# EasyEDA schematic SCH_Head-tracking_2023-07-10.json

## Sheets
1 USB_UART: TITLE: USB_UART CONTROLLER; REV: 1.0; Date: 2022-03-29; Sheet: 1/1; Drawn By: digitalman; Company: Analog-Digital Ltd
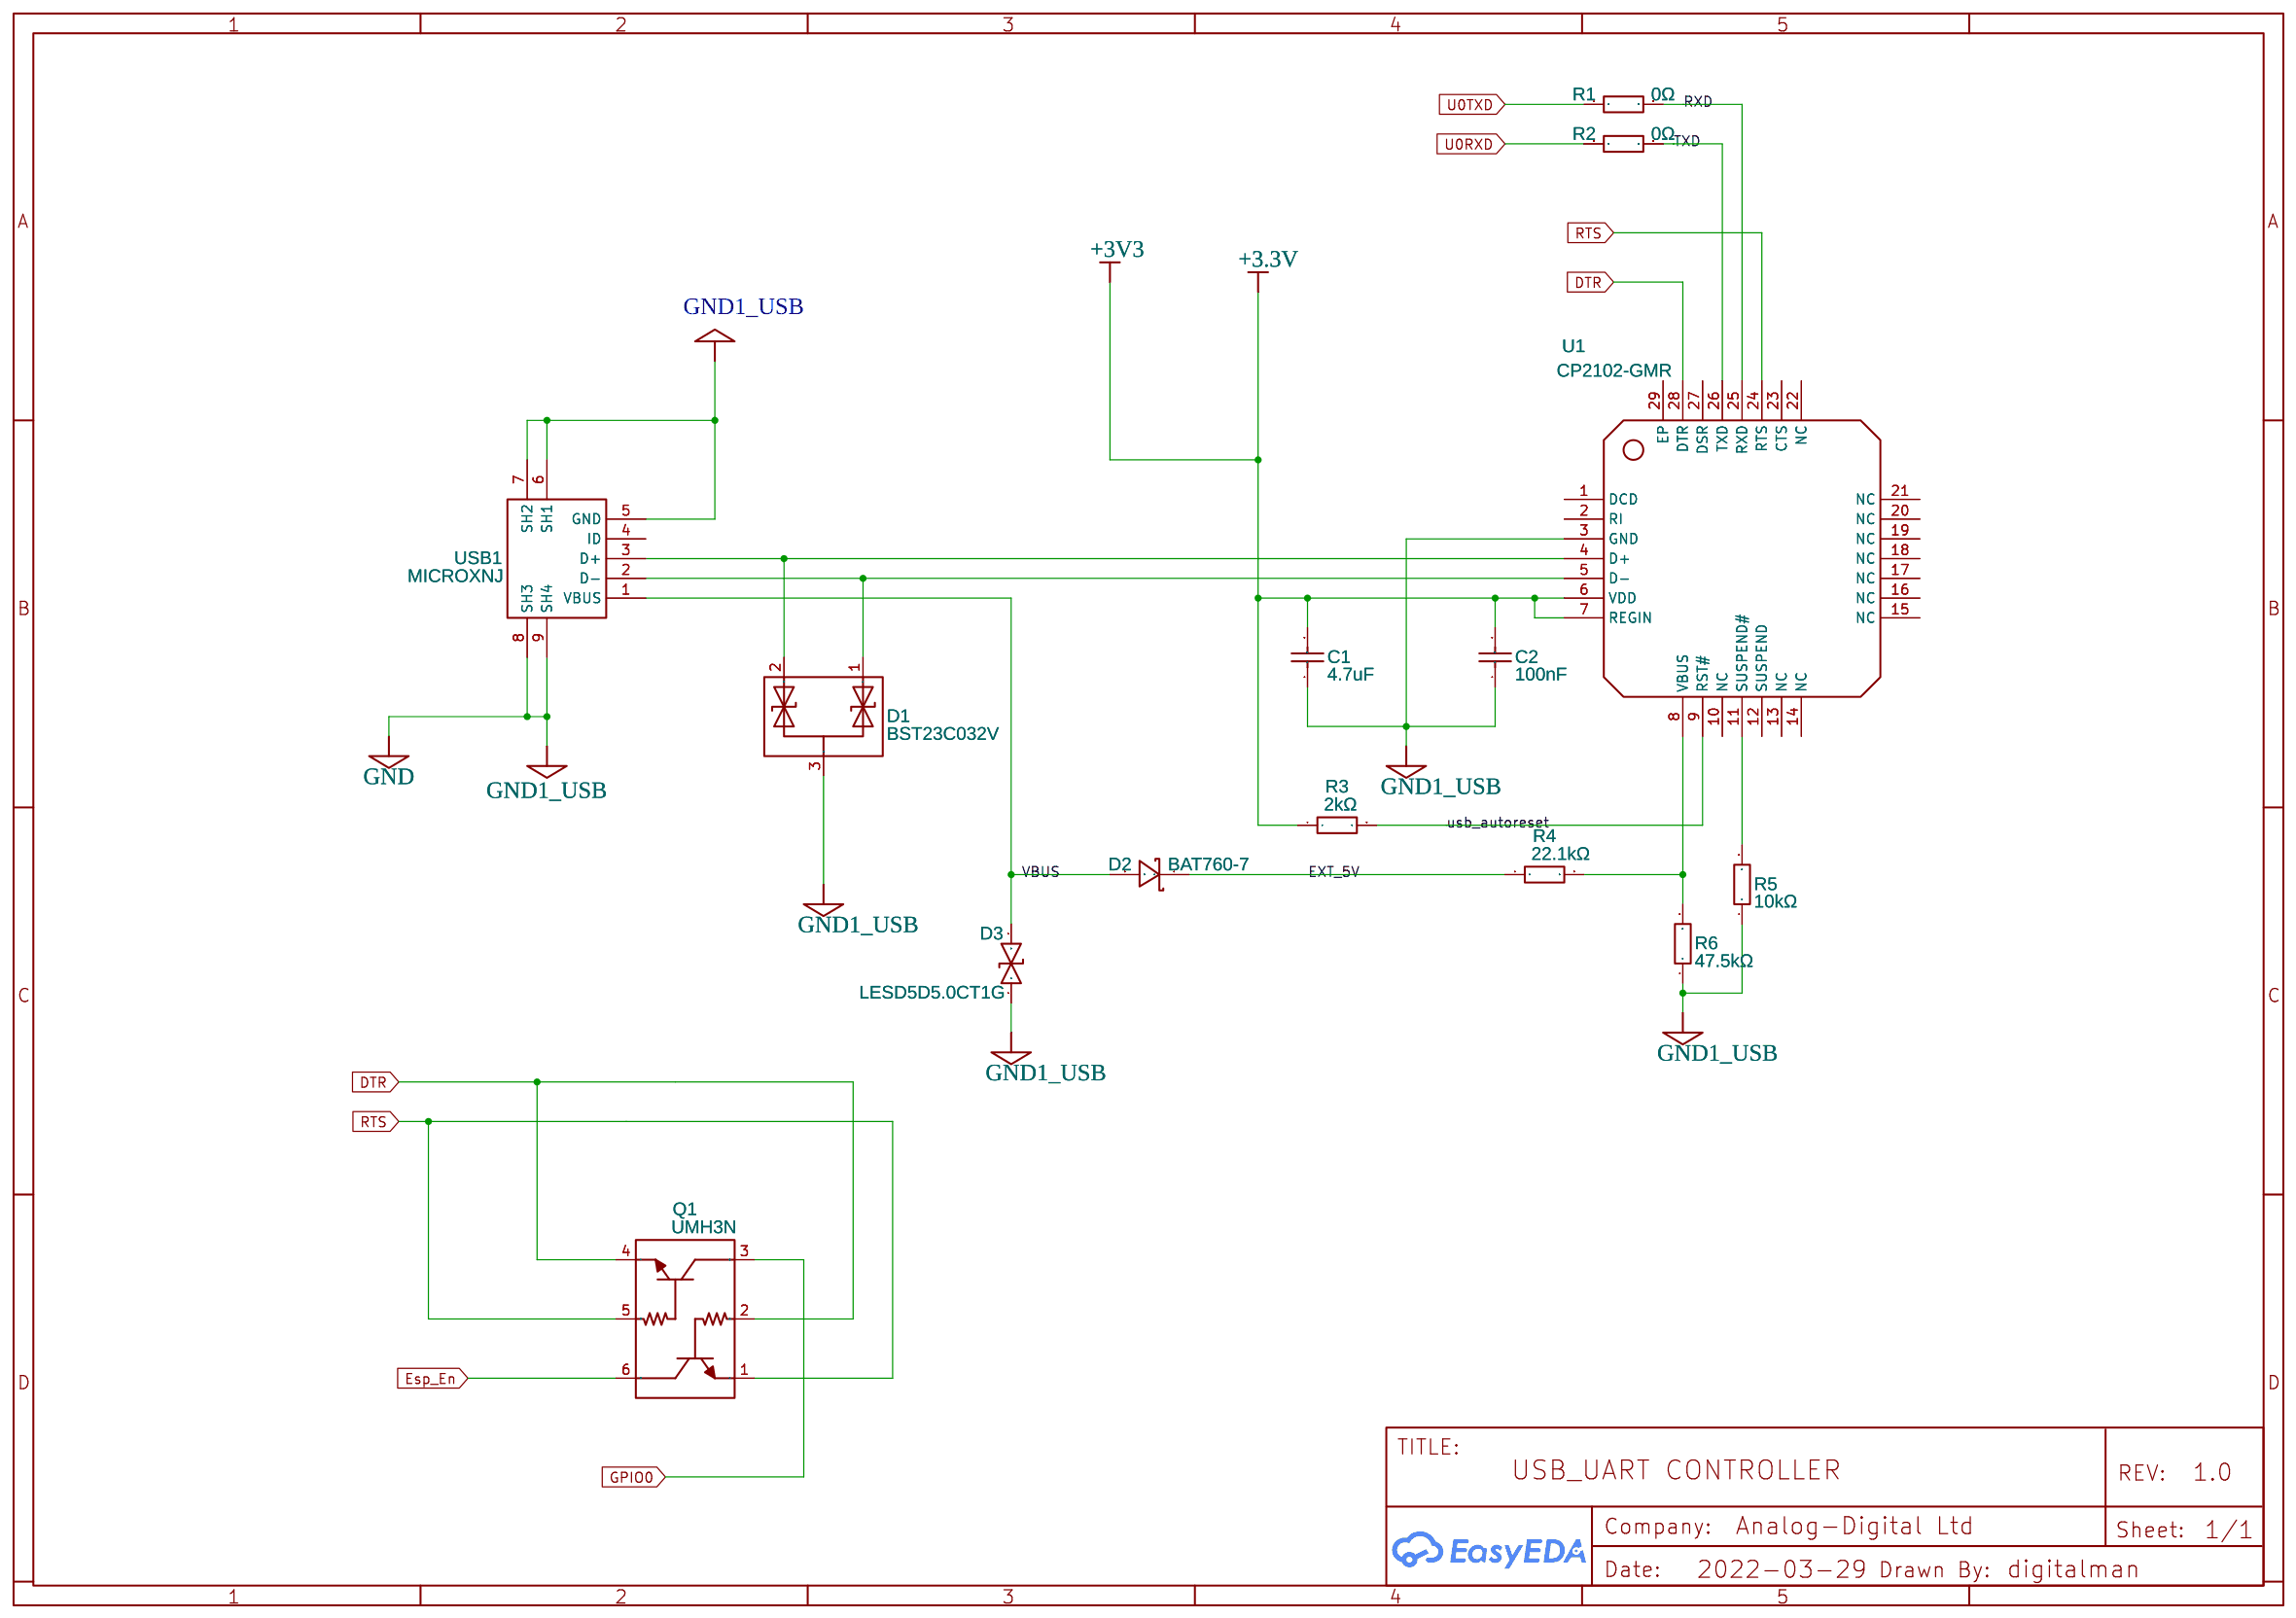
[diagram p0: USB_UART]
2 POWER: TITLE: POWER CONTROL
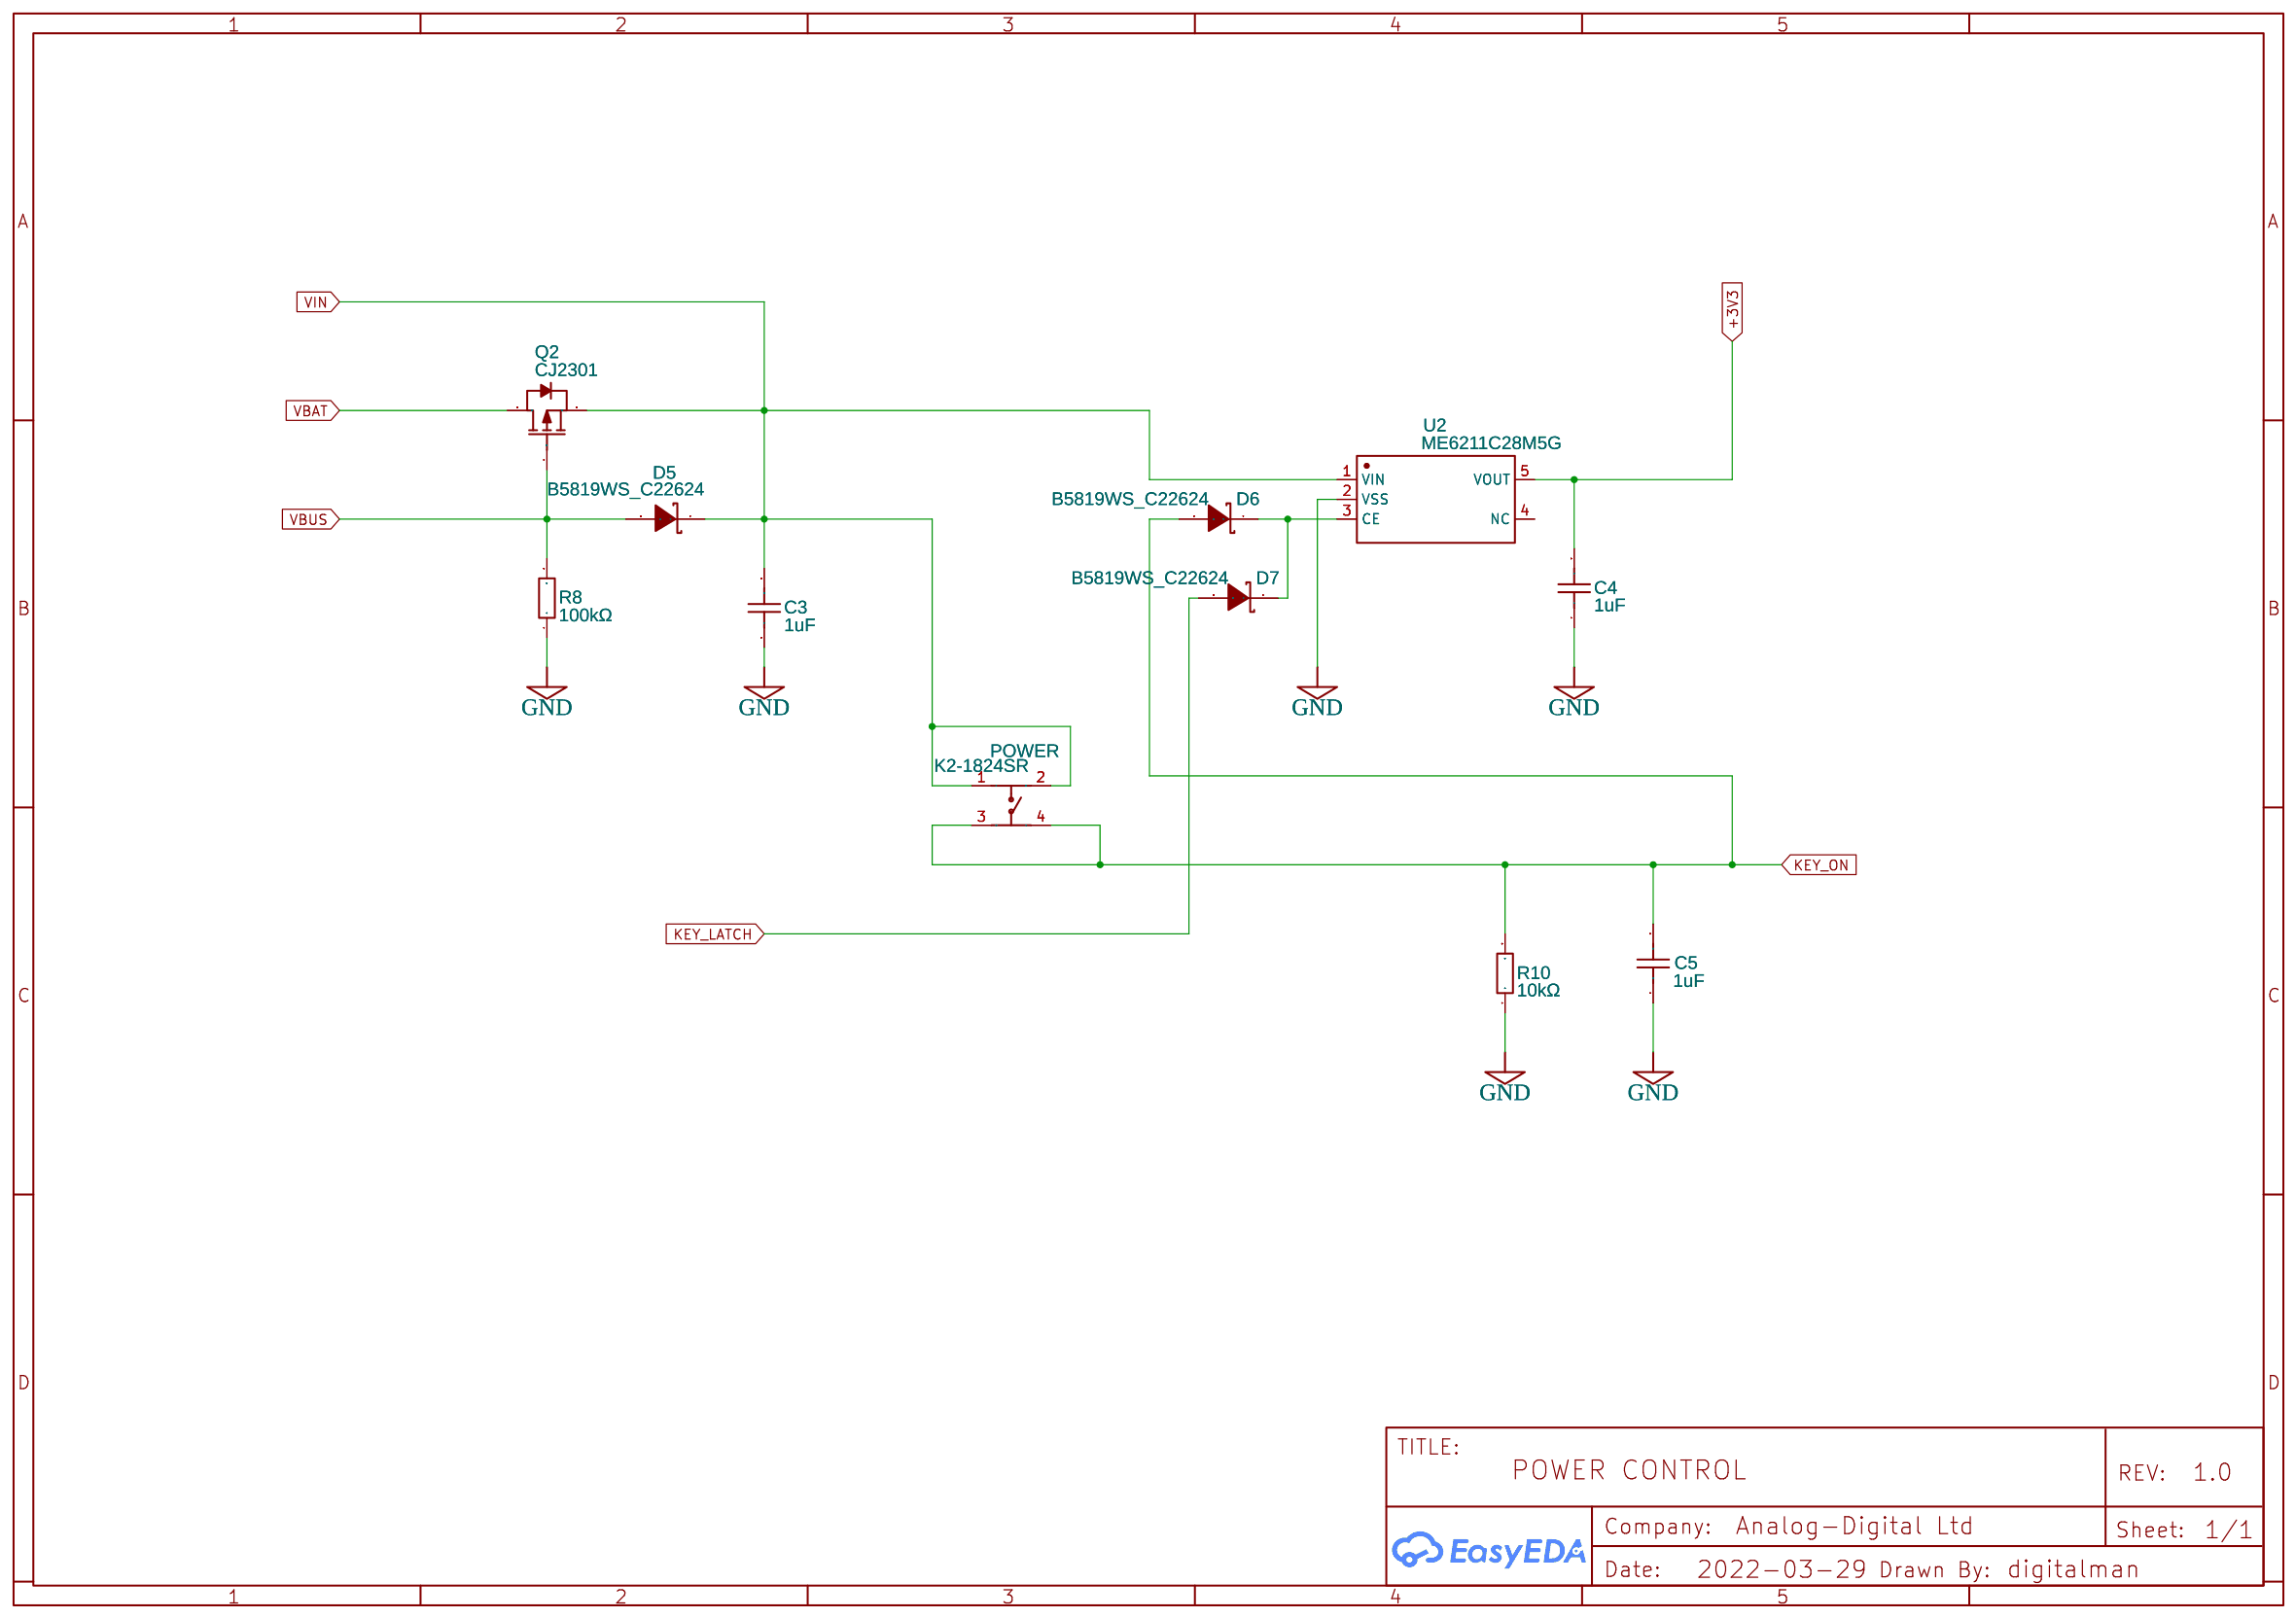
[diagram p1: POWER]
3 CHARGER: TITLE: CHARGER FOR 3.7V BATTERY
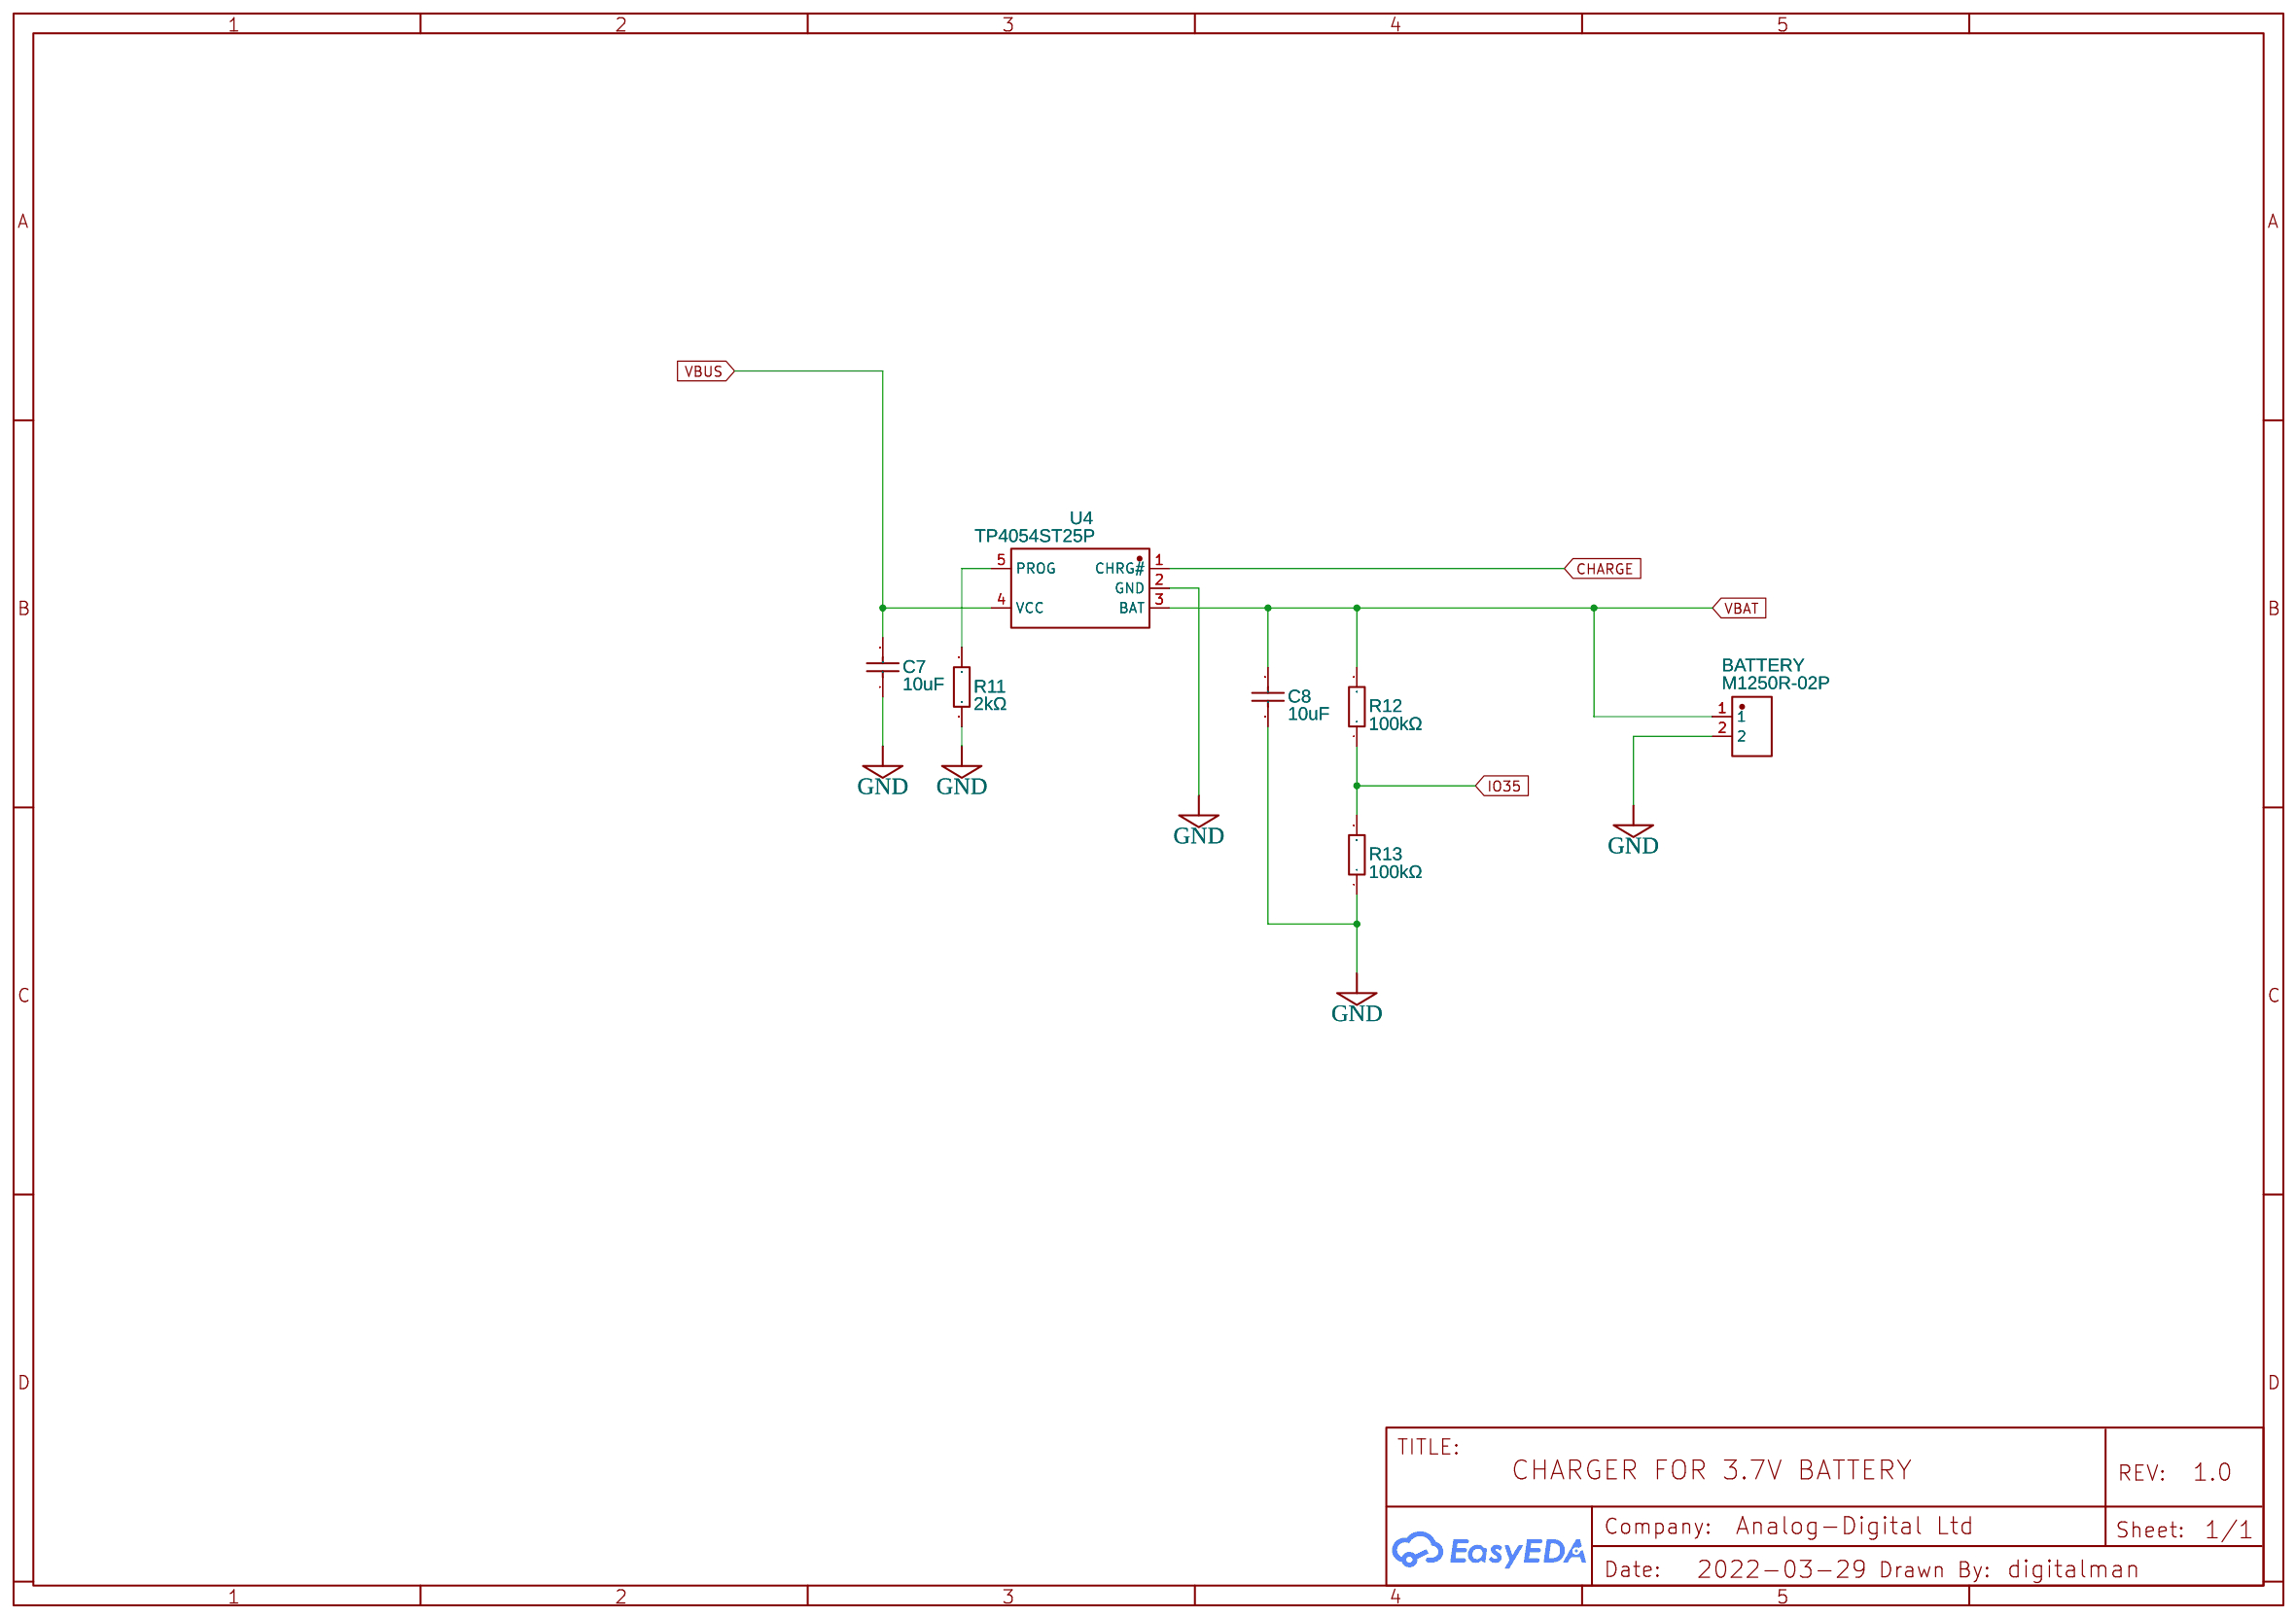
[diagram p2: CHARGER]
4 IMU-SENSOR: TITLE: IMU SENSOR: REPLACE WITH BMI160
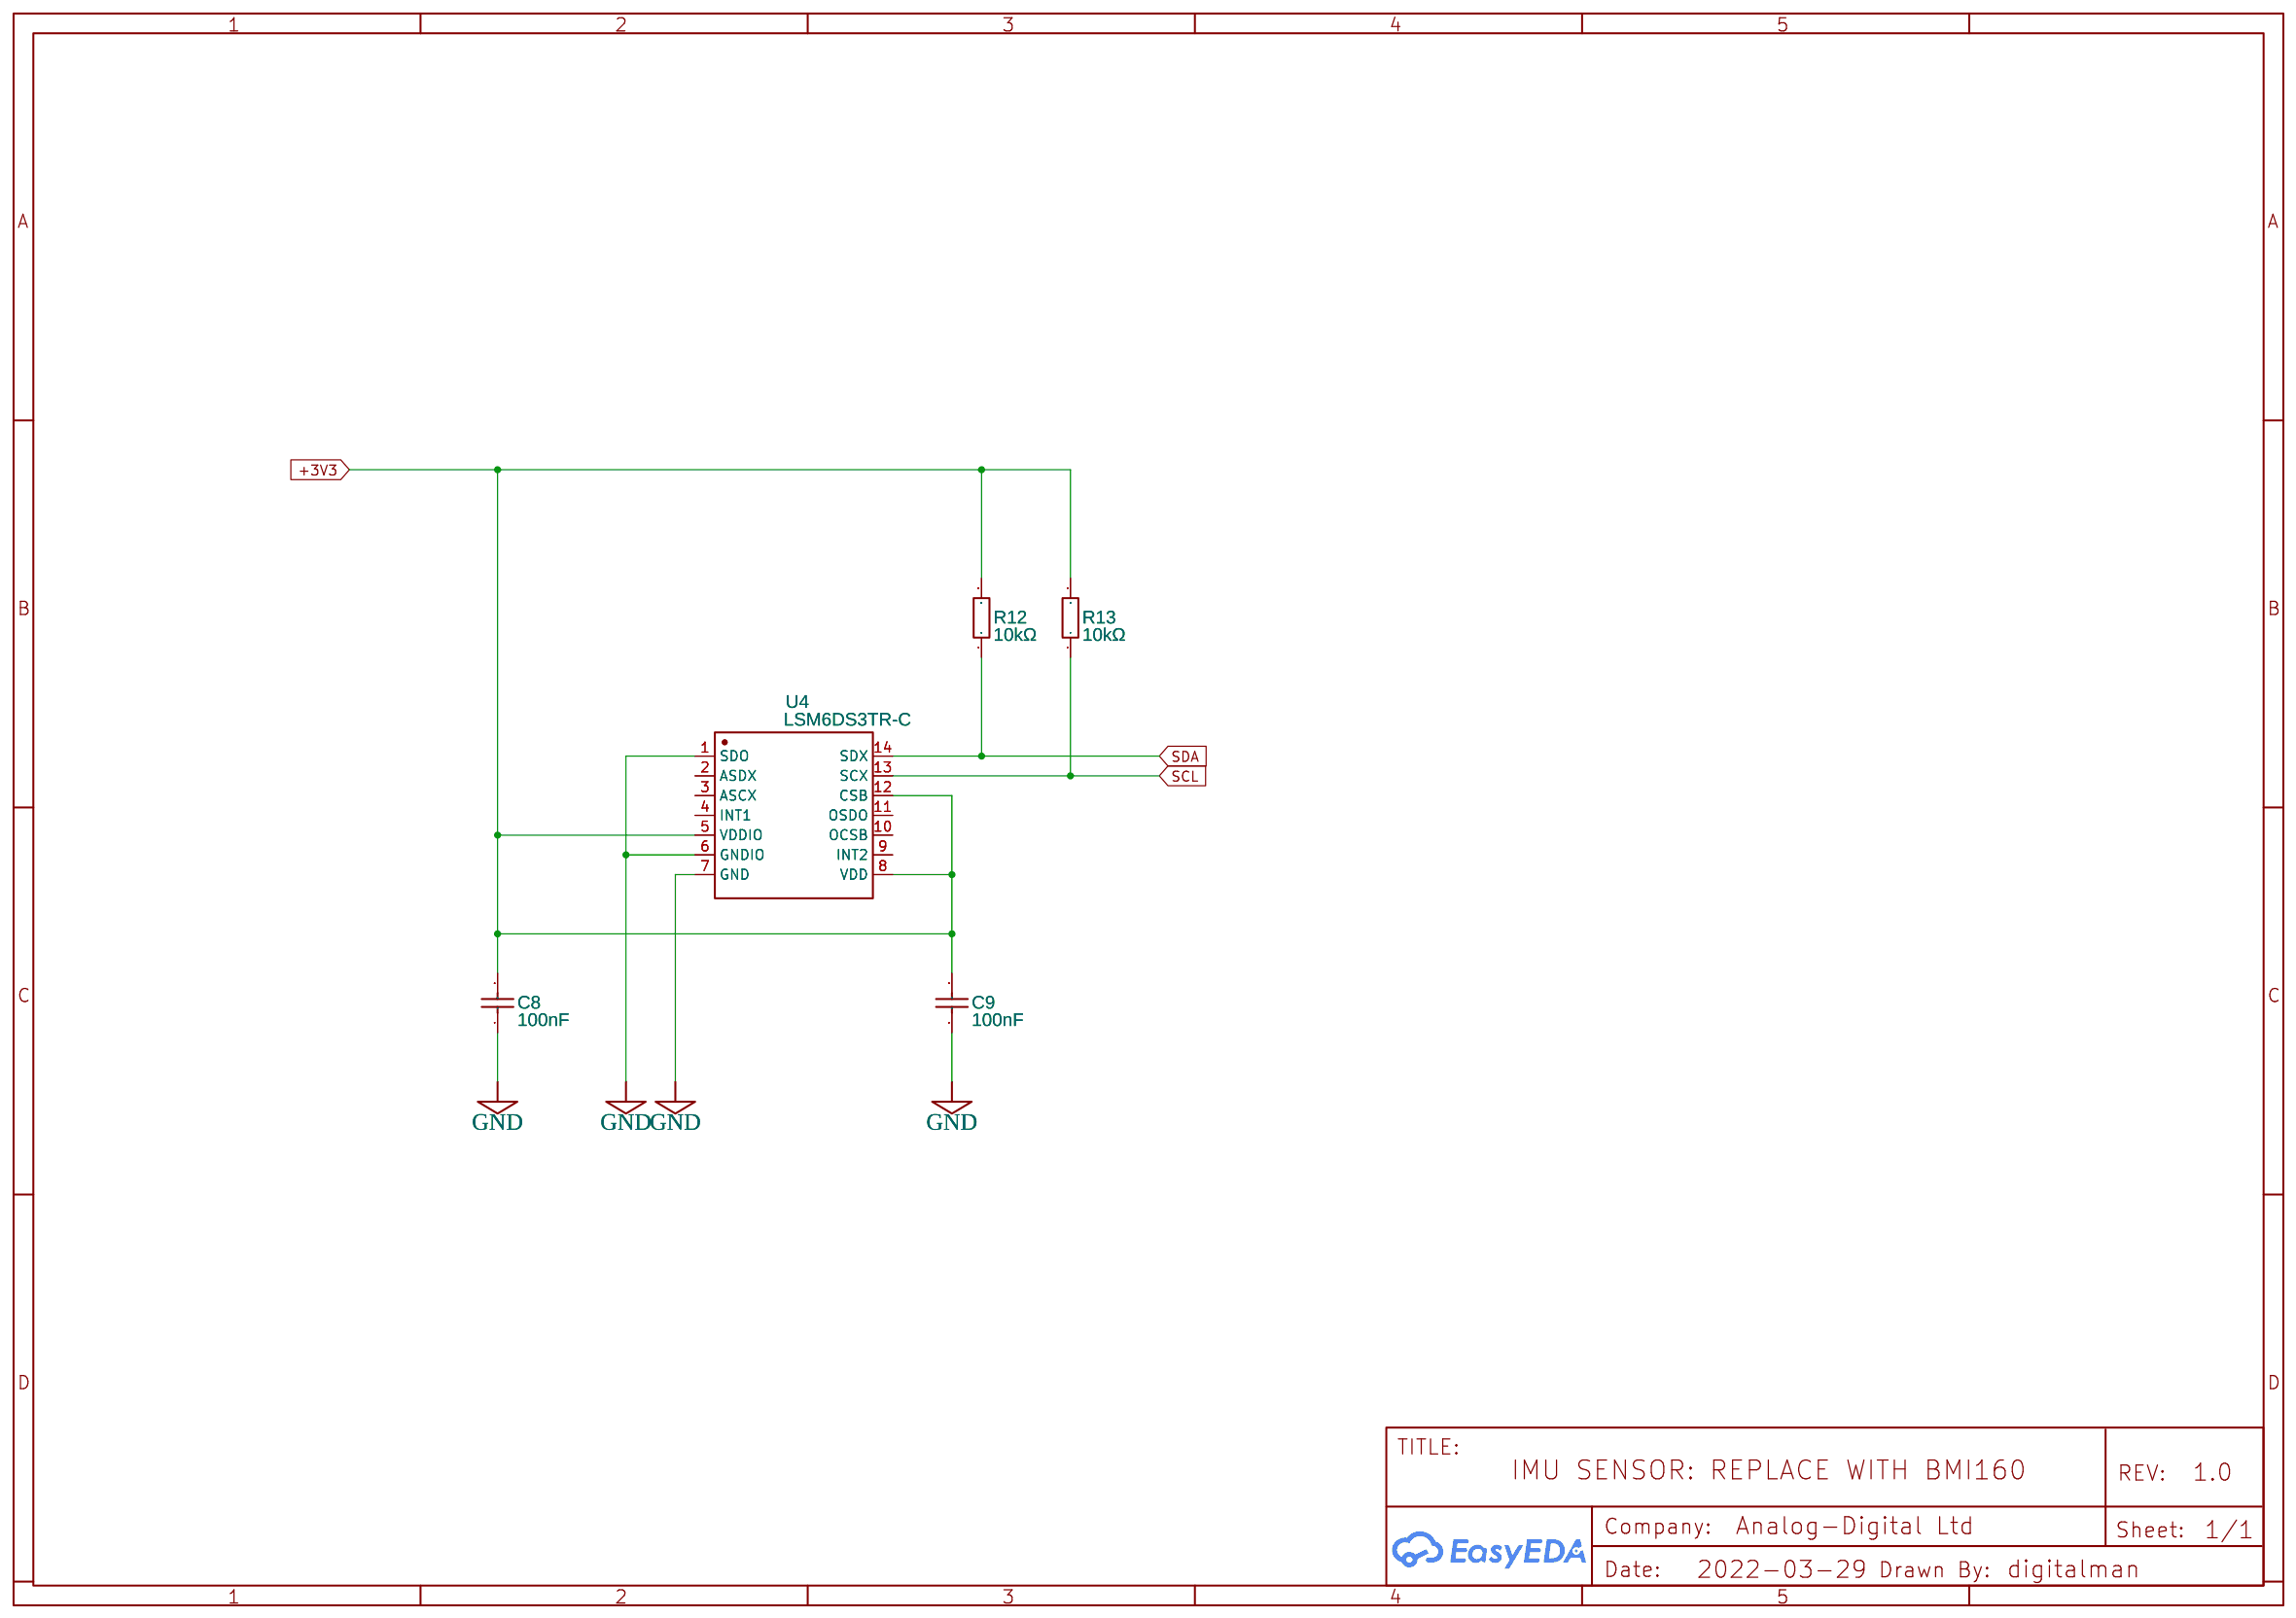
[diagram p3: IMU-SENSOR]
5 MCU: TITLE: ESP32 MCU DUAL CORE
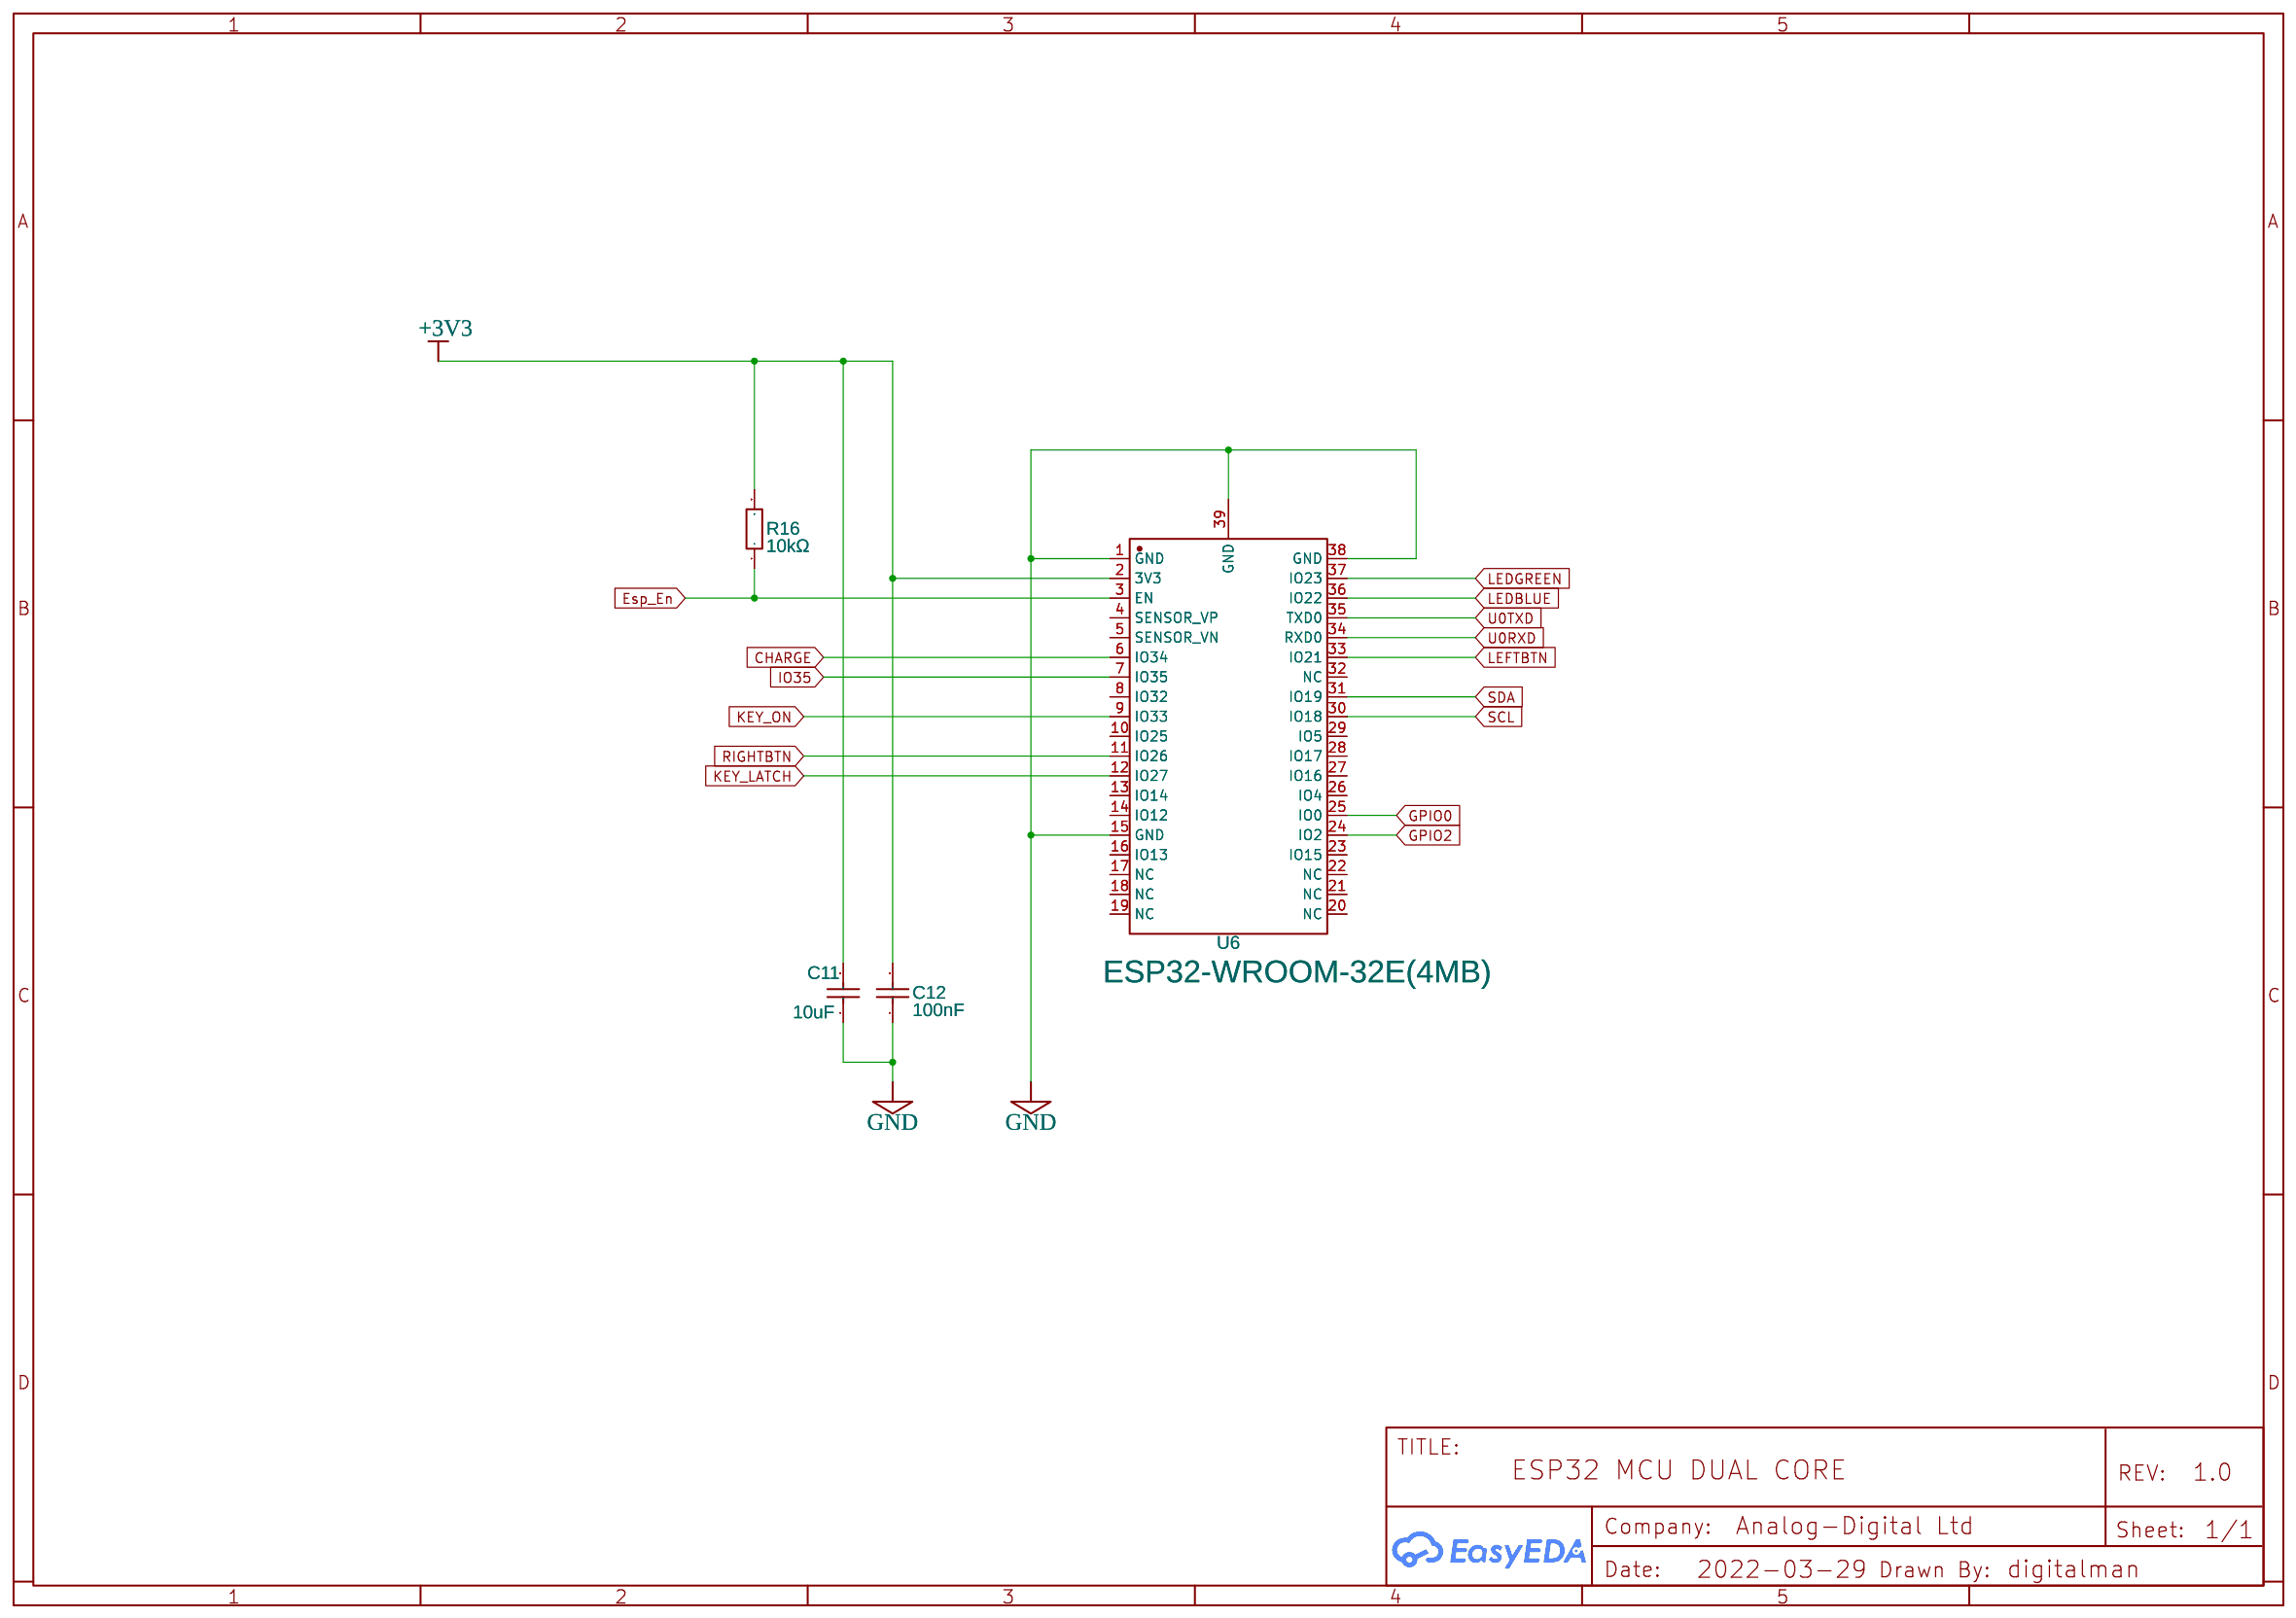
[diagram p4: MCU]
6 LEDS: TITLE: LED CONTROL
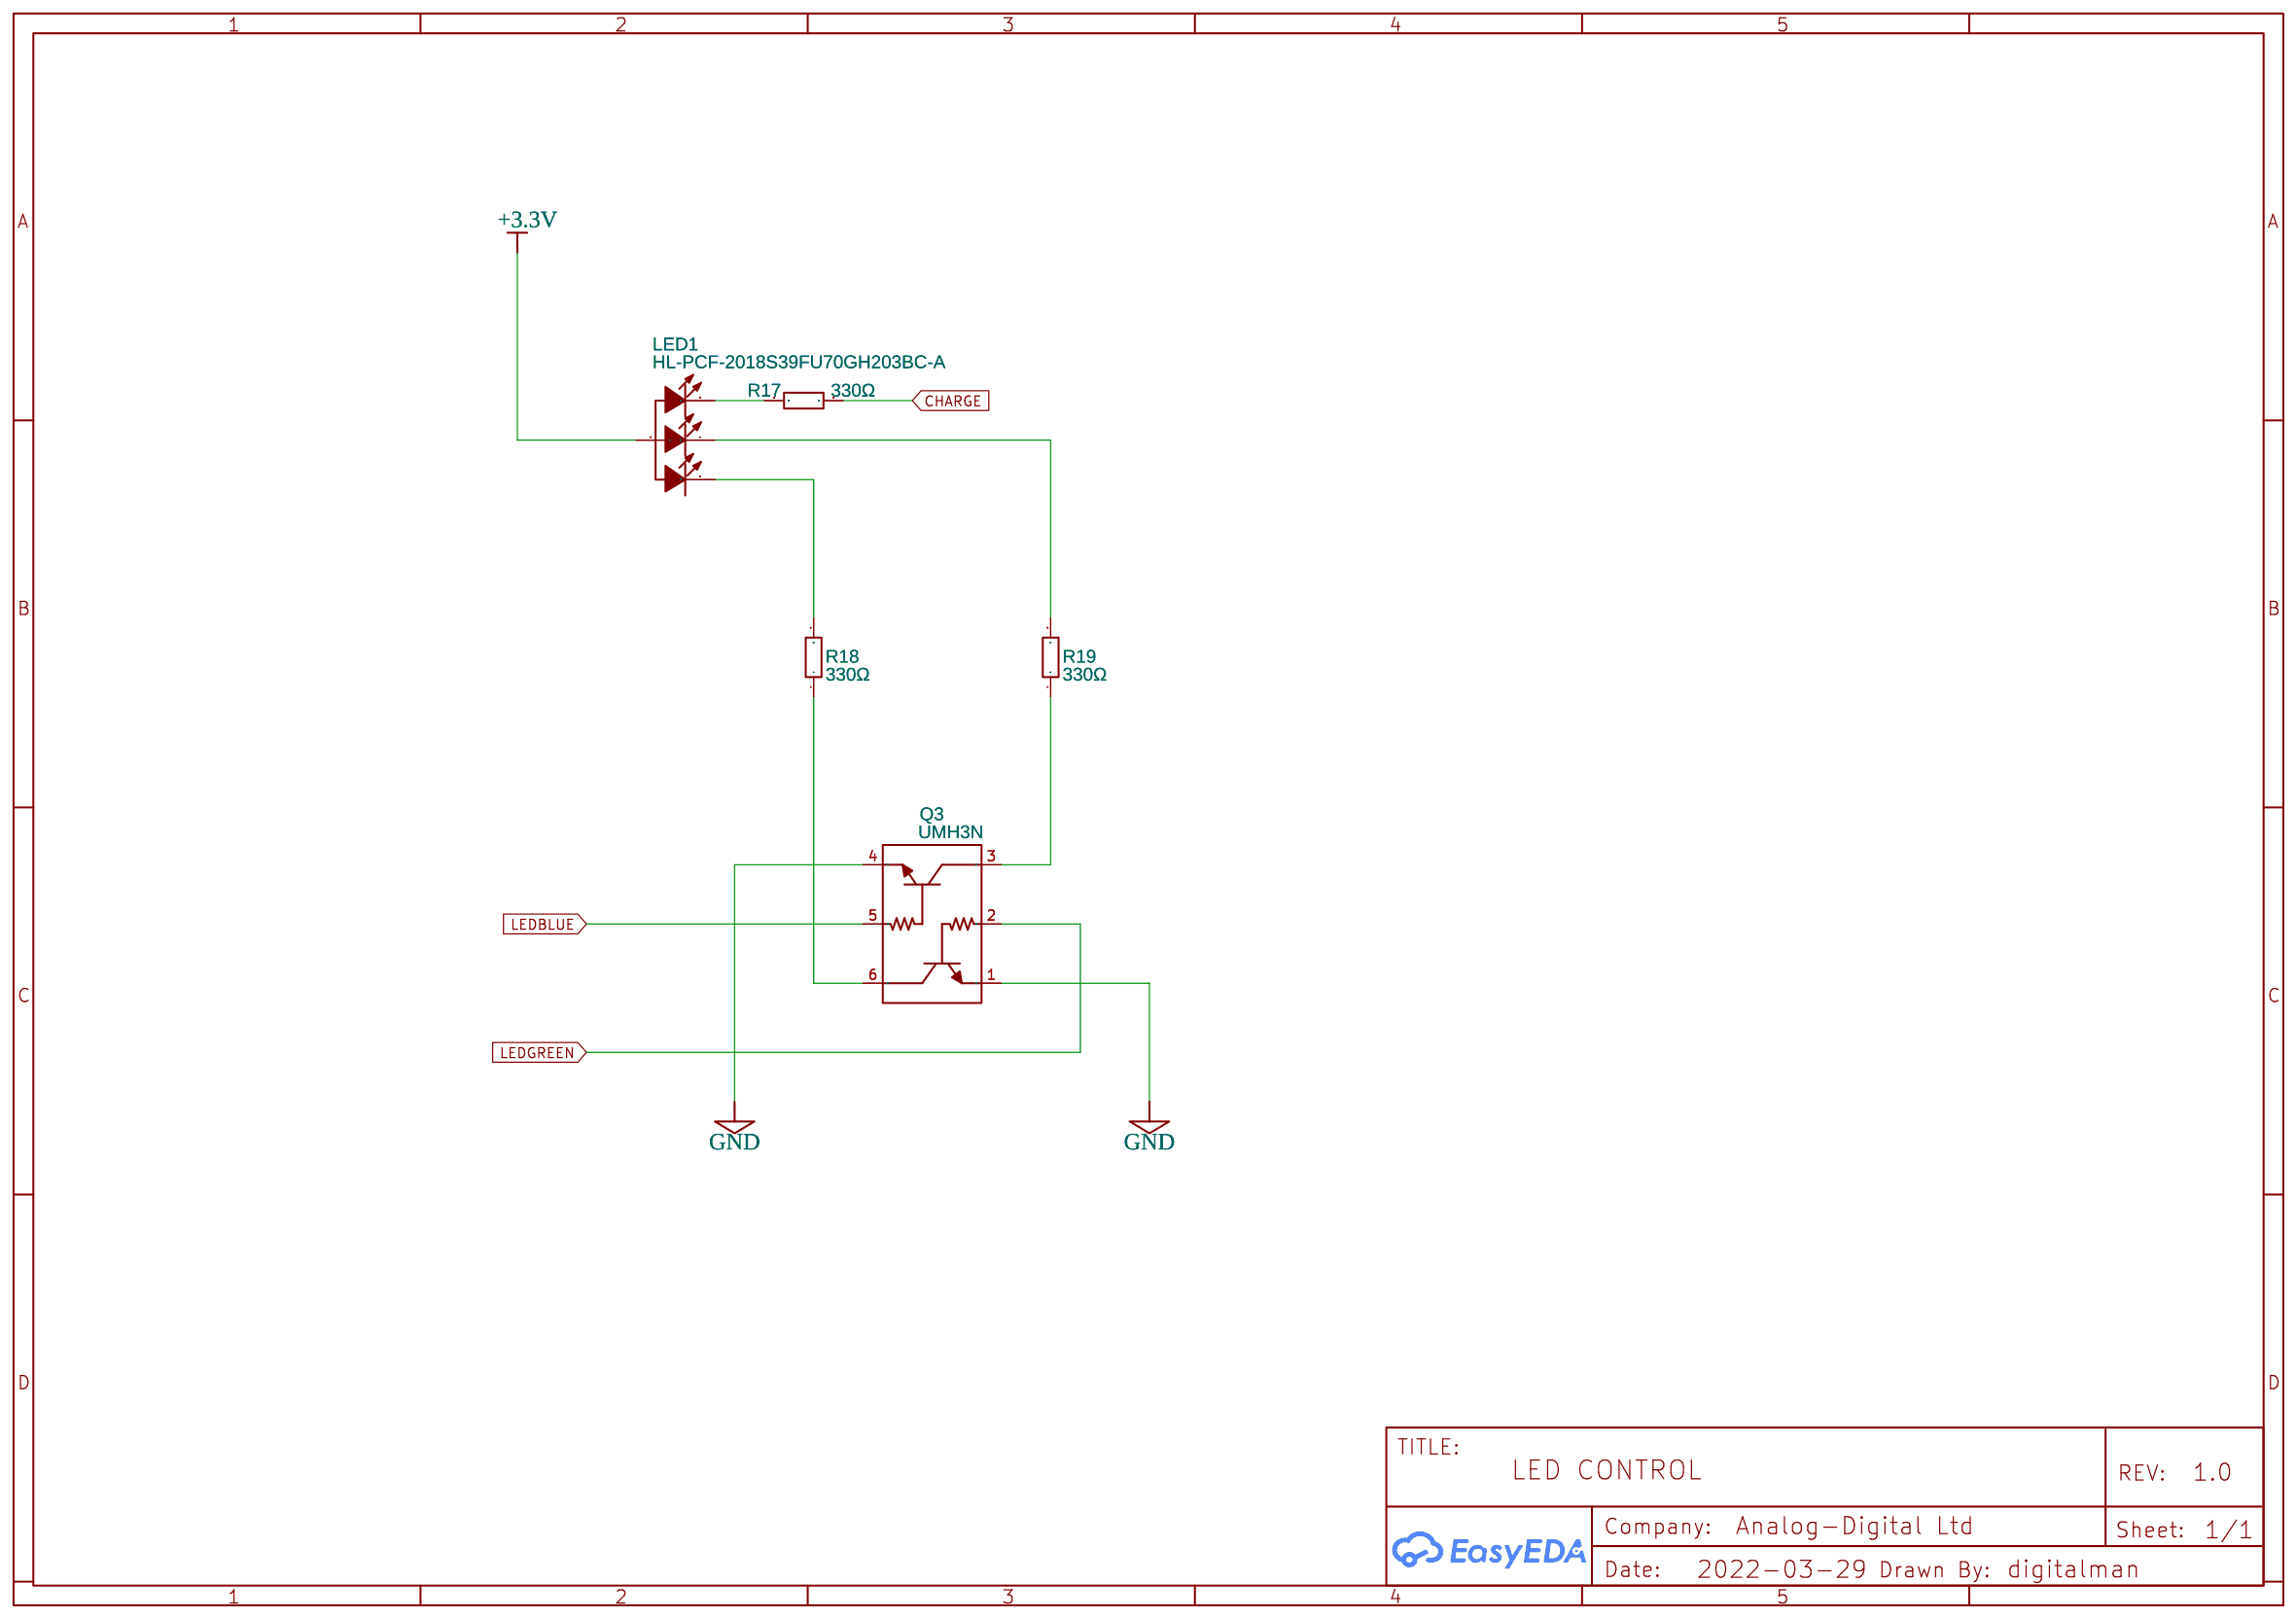
[diagram p5: LEDS]
7 BUTTONS: TITLE: SWITCHES AND BUTTONS
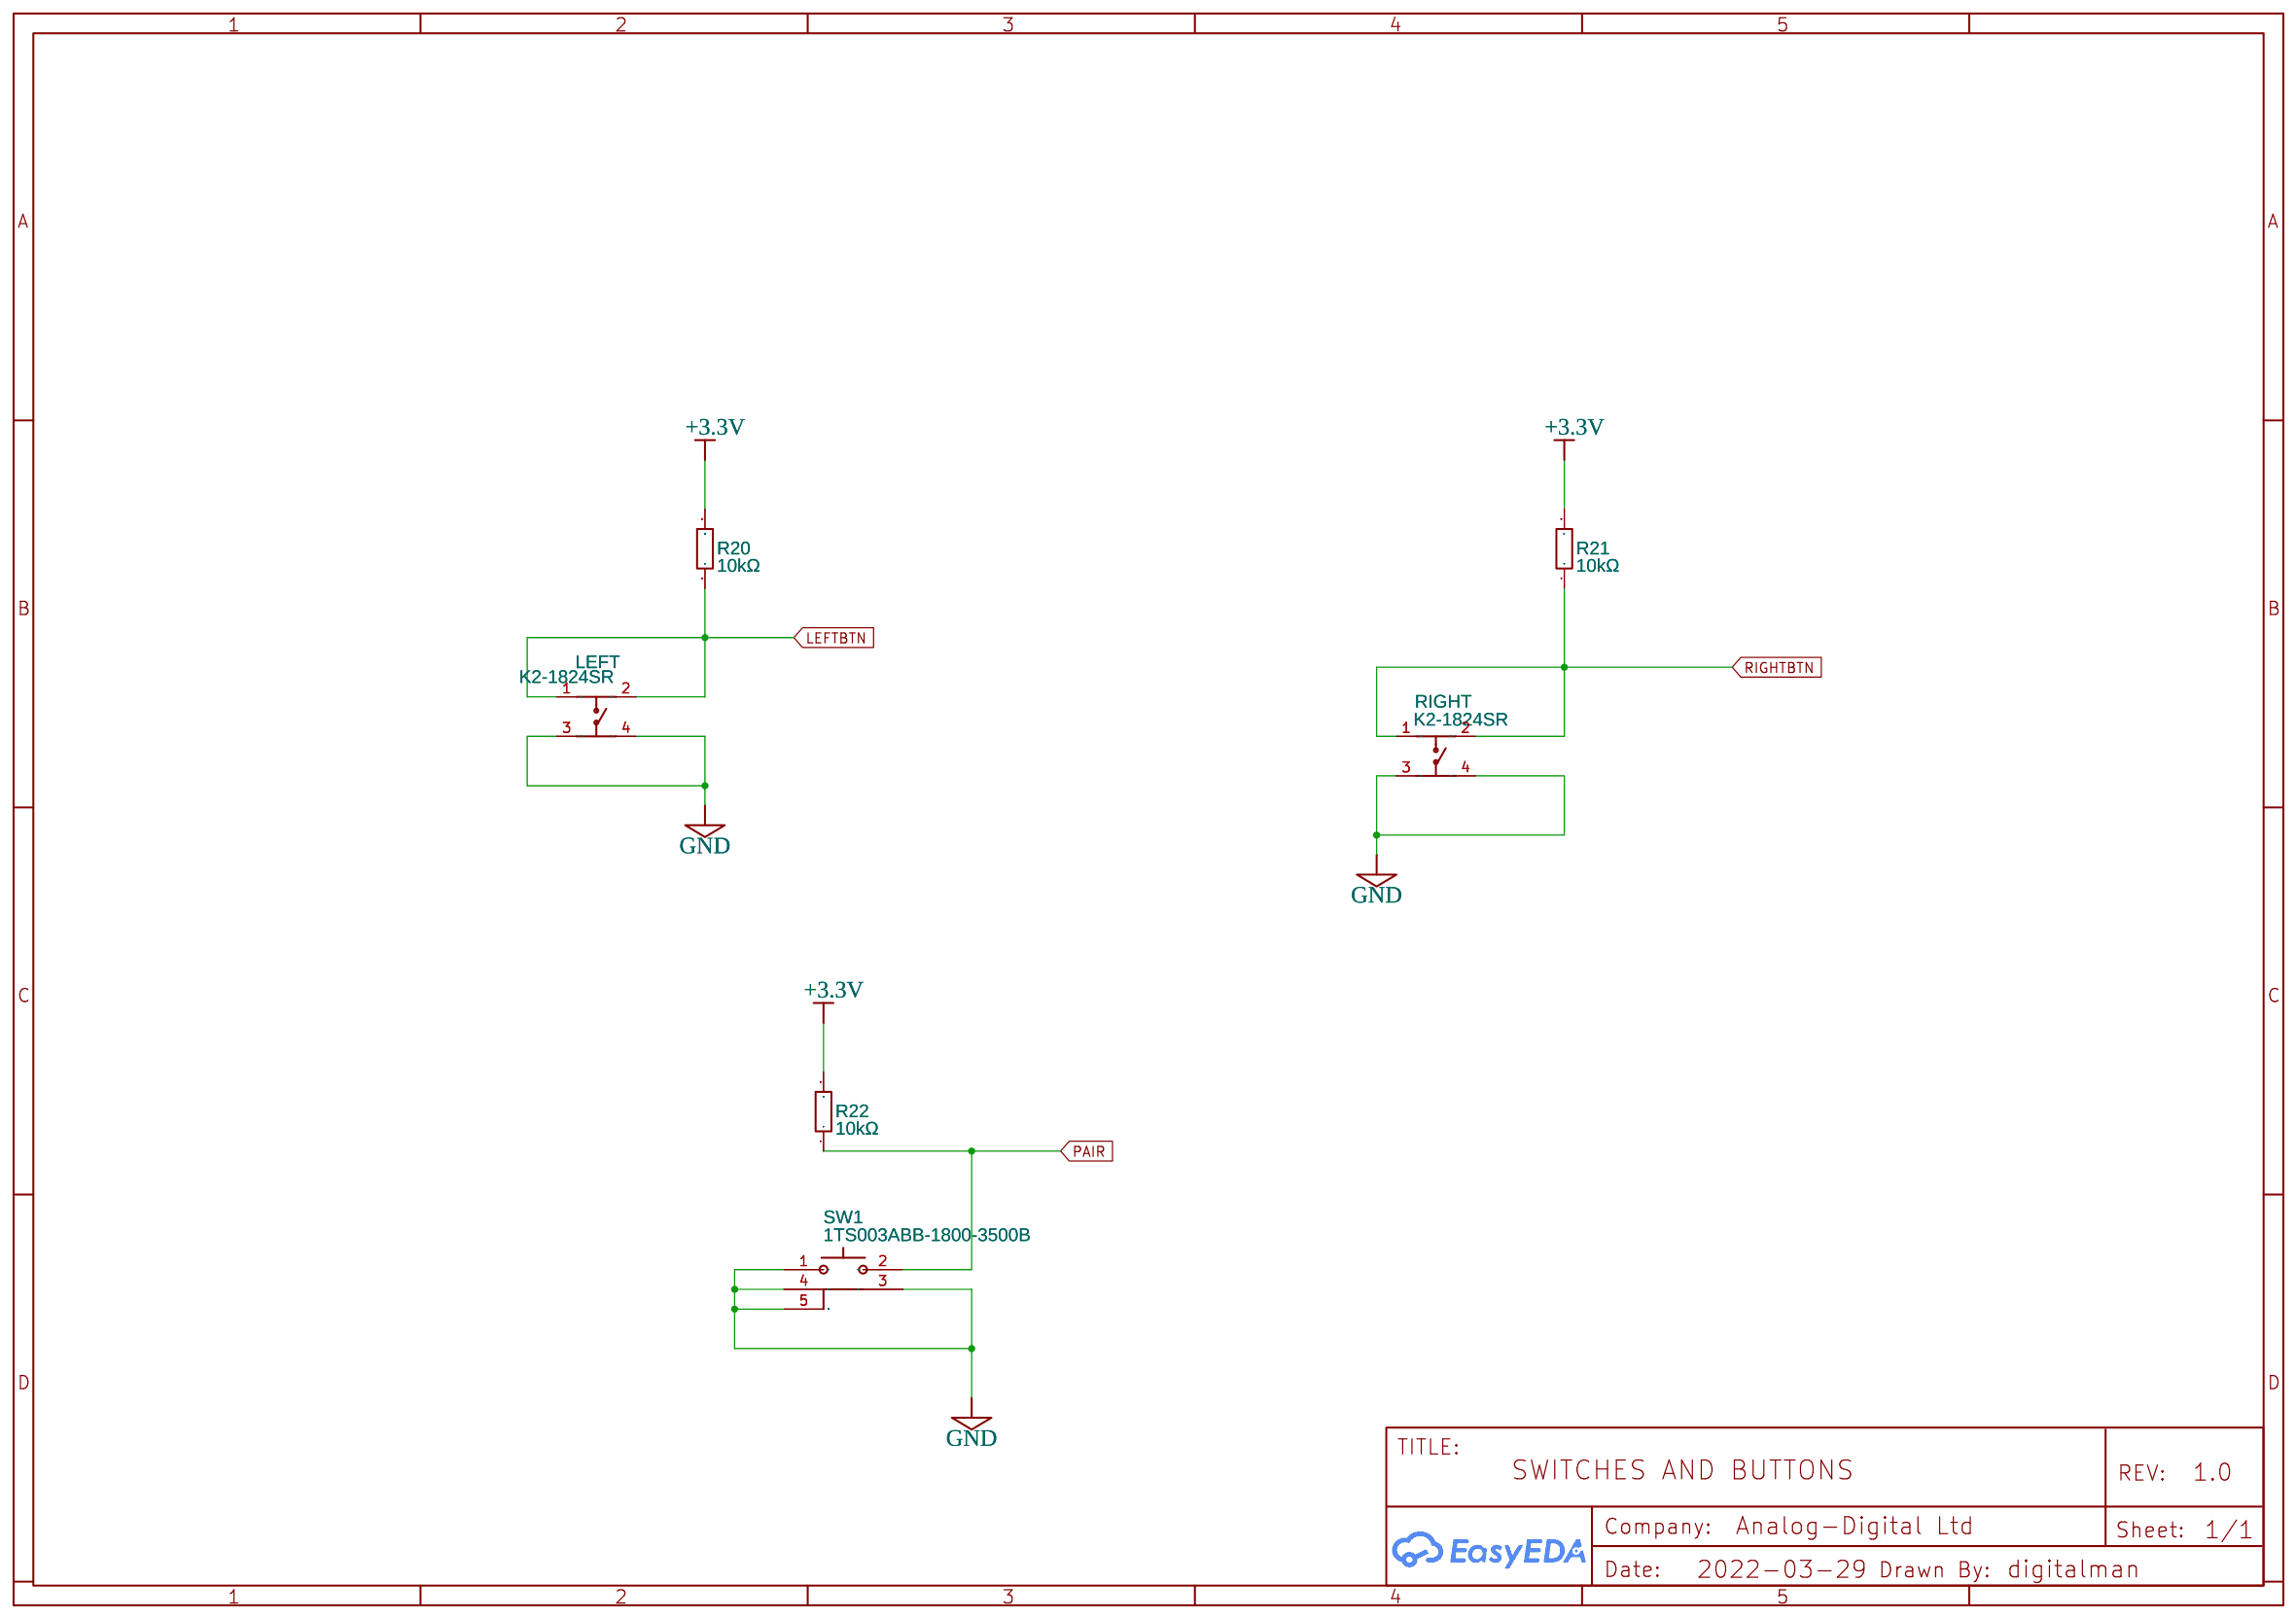
[diagram p6: BUTTONS]
8 Proximity_Sense: TITLE: PROXIMITY SENSOR; Date: 2022-03-31
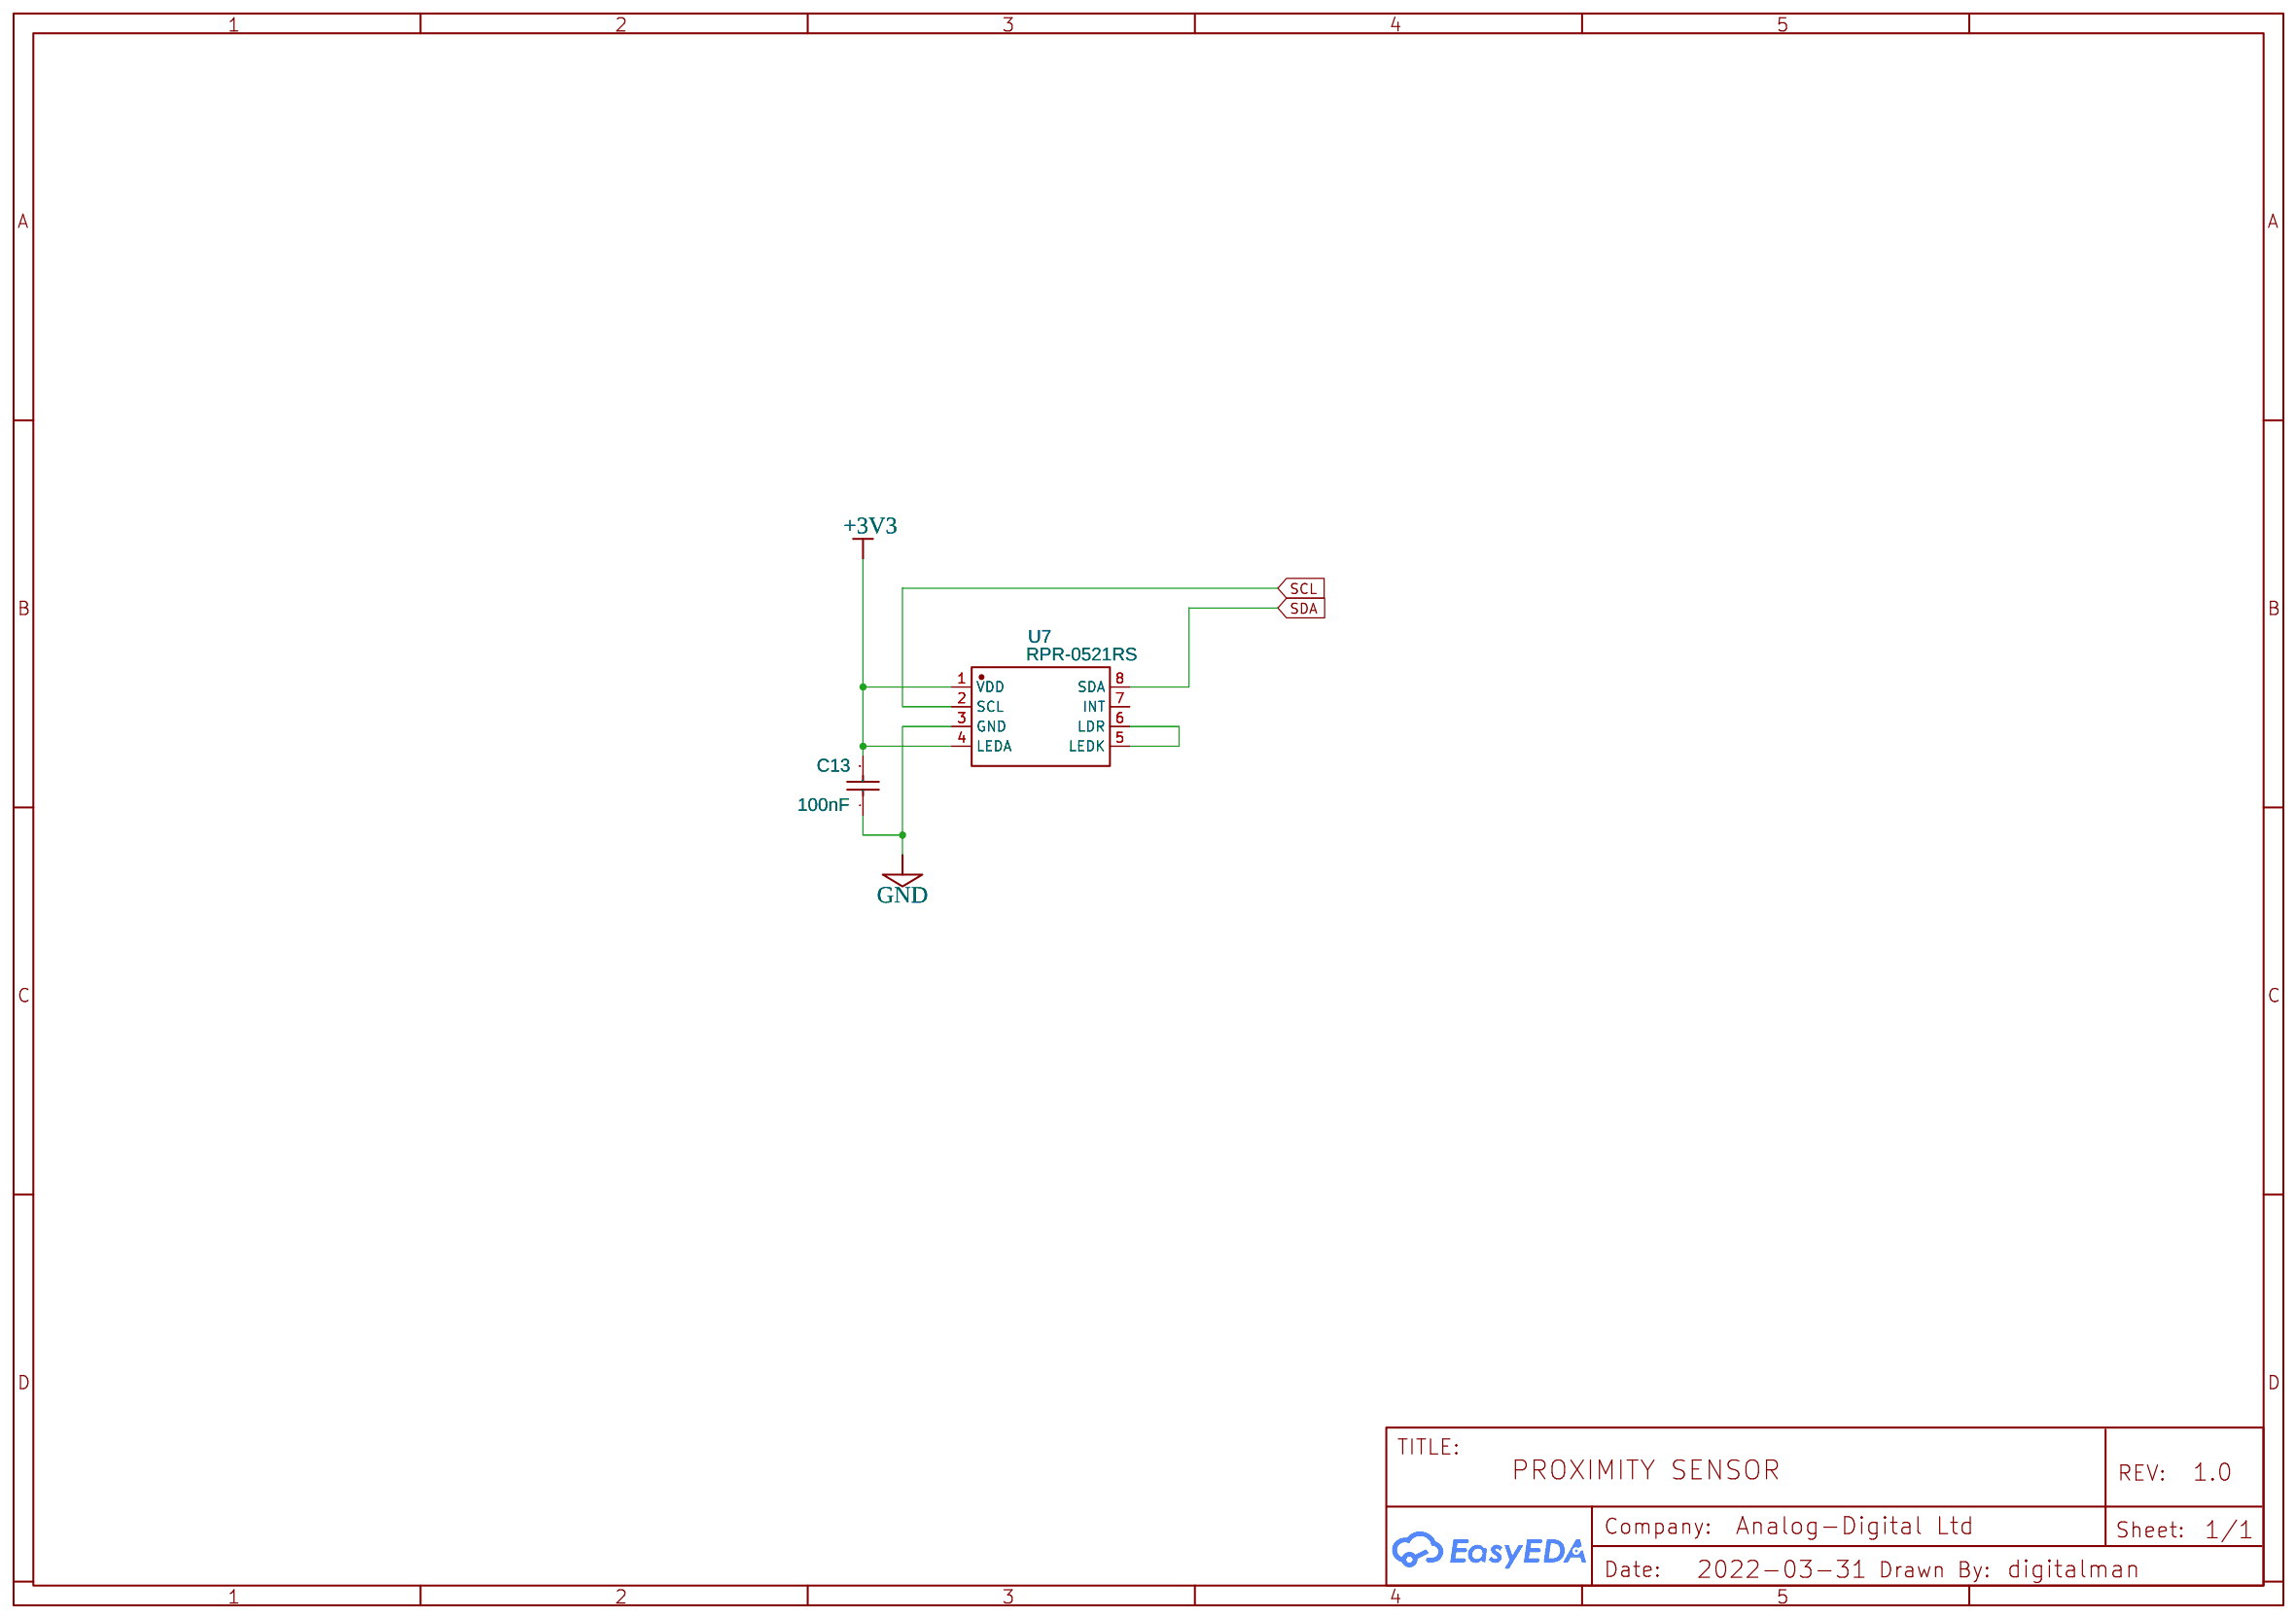
[diagram p7: Proximity_Sense]

## Parts
sheet BUTTONS
LEFT  K2-1824SR  [SW-SMD_4P-L4.5-W4.5-P3.50-LS5.0]
R20  10kΩ  [R0603]
R21  10kΩ  [R0603]
R22  10kΩ  [R0603]
RIGHT  K2-1824SR  [SW-SMD_4P-L4.5-W4.5-P3.50-LS5.0]
SW1  1TS003ABB-1800-3500B  [KEY-SMD_1TS003A]
sheet CHARGER
BATTERY  M1250R-02P  [CONN-TH_2P-P1.25_L4.7-W4.3]
C7  10uF  [C0603]
C8  10uF  [C0603]
R11  2kΩ  [R0603]
R12  100kΩ  [R0603]
R13  100kΩ  [R0603]
U4  TP4054ST25P  [SOT-23-5_L2.9-W1.6-P0.95-LS2.8-BL]
sheet IMU-SENSOR
C8#2  100nF  [C0603]
C9  100nF  [C0603]
R12#2  10kΩ  [R0603]
R13#2  10kΩ  [R0603]
U4#2  LSM6DS3TR-C  [LGA-14_L3.0-W2.5-P0.50-BL]
sheet LEDS
LED1  HL-PCF-2018S39FU70GH203BC-A  [LED-ARRAY-SMD_4P-L2.0-W1.R8-TL]
Q3  UMH3N  [SC-70-6_L2.2-W1.3-P0.65-LS2.1-BR]
R17  330Ω  [R0603]
R18  330Ω  [R0603]
R19  330Ω  [R0603]
sheet MCU
C11  10uF  [C0603]
C12  100nF  [C0603]
R16  10kΩ  [R0603]
U6  ESP32-WROOM-32E(4MB)  [WIFI-SMD_ESP32-WROOM-32E]
sheet POWER
C3  1uF  [C0603]
C4  1uF  [C0603]
C5  1uF  [C0603]
D5  B5819WS_C22624  [SOD-323_L1.8-W1.3-LS2.5-RD]
D6  B5819WS_C22624  [SOD-323_L1.8-W1.3-LS2.5-RD]
D7  B5819WS_C22624  [SOD-323_L1.8-W1.3-LS2.5-RD]
POWER  K2-1824SR  [SW-SMD_4P-L4.5-W4.5-P3.50-LS5.0]
Q2  CJ2301  [SOT-23-3_L2.9-W1.3-P1.90-LS2.4-BR]
R8  100kΩ  [R0603]
R10  10kΩ  [R0603]
U2  ME6211C28M5G  [SOT-23-5_L3.0-W1.7-P0.95-LS2.8-BR]
sheet Proximity_Sense
C13  100nF  [C0603]
U7  RPR-0521RS  [SENSOR-SMD_RPR-0521RS]
sheet USB_UART
C1  4.7uF  [C0603]
C2  100nF  [C0603]
D1  BST23C032V  [SOT-23_L2.9-W1.3-P1.90-LS2.4-BR]
D2  BAT760-7  [SOD-323_L1.8-W1.3-LS2.5-RD]
D3  LESD5D5.0CT1G  [SOD-523_L1.2-W0.8-LS1.6-BI]
Q1  UMH3N  [SC-70-6_L2.2-W1.3-P0.65-LS2.1-BR]
R1  0Ω  [R0603]
R2  0Ω  [R0603]
R3  2kΩ  [R0603]
R4  22.1kΩ  [R0603]
R5  10kΩ  [R0603]
R6  47.5kΩ  [R0603]
U1  CP2102-GMR  [QFN-28_L5.0-W5.0-P0.50-BL-EP]
USB1  MICROXNJ  [MICRO-USB-SMD_MICROXNJ]

## Library data of the parts
LEFT POWER RIGHT = K2-1824SR-B4SW-06: Supplier: LCSC; Manufacturer: HRO; Contributor: LCSC; Supplier Part: C128938; JLCPCB Part Class: Extended Part
R5 R10 R12#2 R13#2 R16 R20-R22 = RS-03K1002FT: Supplier: LCSC; Supplier Part: C115324; Manufacturer: Guangdong Fenghua Advanced Tech; Resistance (Ohms): 10K; Contributor: LCSC; JLCPCB Part Class: Extended Part
SW1 = 1TS003ABB-1800-3500B: Supplier: LCSC; Supplier Part: C319390; Manufacturer: HYP; Contributor: LCSC; JLCPCB Part Class: Extended Part
BATTERY = M1250R-02P: Supplier: LCSC; Supplier Part: C481436; Manufacturer: XFCN; Contributor: LCSC; JLCPCB Part Class: Extended Part
C7 C8 C11 = CL10A106MO8NQNC: Supplier: LCSC; Manufacturer: SAMSUNG; Supplier Part: C92487; JLCPCB Part Class: Extended Part
R3 R11 = RS-03K2001FT: Supplier: LCSC; Manufacturer: FH; Supplier Part: C115336; Resistance (Ohms): 2K; JLCPCB Part Class: Extended Part
R8 R12 R13 = RS-03K1003FT_C115320: Supplier: LCSC; Manufacturer: FH; Manufacturer Part: RS-03K1003FT; Resistance (Ohms): 100K; Contributor: LCSC; Supplier Part: C115320; JLCPCB Part Class: Extended Part
U4 = TP4054ST25P: Supplier: LCSC; Supplier Part: C382138; Manufacturer: TPOWER; Contributor: LCSC; JLCPCB Part Class: Extended Part
C2 C8#2 C9 C12 C13 = CL10B104KO8NNNC: Supplier: LCSC; Manufacturer: SAMSUNG; Supplier Part: C66501; JLCPCB Part Class: Extended Part
U4#2 = BMI160: Supplier: LCSC; Manufacturer: STMicroelectronics; Supplier Part: C967633; JLCPCB Part Class: Extended Part
LED1 = HL-PCF-2018S39FU70GH203BC-A: Supplier: LCSC; Supplier Part: C513367; Manufacturer: HONGLITRONIC(Hongli Zhihui (HONGLITRONIC)); Contributor: LCSC
Q1 Q3 = UMH3N: Supplier: LCSC; Manufacturer: CJ; Supplier Part: C62892; JLCPCB Part Class: Extended Part
R17-R19 = RS-03K331FT: Supplier: LCSC; Manufacturer: FH; Resistance (Ohms): 330; Contributor: LCSC; Supplier Part: C125768; JLCPCB Part Class: Extended Part
U6 = ESP32-WROOM-32E(4MB): Supplier: LCSC; Supplier Part: C701341; Manufacturer: Espressif Systems; Contributor: LCSC; JLCPCB Part Class: Extended Part
C3-C5 = 0603B105K160NT: Supplier: LCSC; Manufacturer: FH; Supplier Part: C93816; JLCPCB Part Class: Extended Part
D5-D7 = B5819WS_C22624: Supplier: LCSC; Manufacturer Part: B5819WS; Manufacturer: CJ; Supplier Part: C22624; JLCPCB Part Class: Extended Part
Q2 = CJ2301: Supplier: LCSC; Supplier Part: C2910170; Manufacturer: CJ（江苏长电/长晶）; Contributor: LCSC
U2 = ME6211C28M5G: Supplier: LCSC; Manufacturer: MICRONE; Manufacturer Part: ME6211C33M5G-N; Supplier Part: C82942; JLCPCB Part Class: Extended Part
U7 = RPR-0521RS: Supplier: LCSC; Supplier Part: C509781; Manufacturer: ROHM(罗姆); JLCPCB Part Class: Extended Part; Contributor: LCSC
C1 = 0603X475K160NT: Supplier: LCSC; Manufacturer: FH; Supplier Part: C99229; JLCPCB Part Class: Extended Part
D1 = BST23C032V: Supplier: LCSC; Supplier Part: C151968; Manufacturer: Bourne Semicon (Shenzhen); Contributor: LCSC; JLCPCB Part Class: Extended Part
D2 = BAT760-7: Supplier: LCSC; Manufacturer: DIODES; Contributor: LCSC; Supplier Part: C124187; JLCPCB Part Class: Extended Part
D3 = LESD5D5.0CT1G: Supplier: LCSC; Supplier Part: C383211; Manufacturer: Leshan Radio; Contributor: LCSC; JLCPCB Part Class: Extended Part
R1 R2 = RS-03000FT: Supplier: LCSC; Manufacturer: FH; Resistance (Ohms): 0; Contributor: LCSC; Supplier Part: C136582; JLCPCB Part Class: Extended Part
R4 = RS-03K2212FT: Supplier: LCSC; Supplier Part: C310274; Manufacturer: Guangdong Fenghua Advanced Tech; Resistance (Ohms): 22.1K; Contributor: LCSC; JLCPCB Part Class: Extended Part
R6 = 0603WAF4752T5E: Supplier: LCSC; Manufacturer: UniOhm; Supplier Part: C23061; Resistance (Ohms): 47.5K; JLCPCB Part Class: Extended Part
U1 = CP2102-GMR: Supplier: LCSC; Manufacturer: SILICON LABS; Supplier Part: C6568; JLCPCB Part Class: Basic Part
USB1 = MICROXNJ: Supplier: LCSC; Supplier Part: C404969; Manufacturer: SHOU HAN; Manufacturer Part: MicroXNJ; Contributor: LCSC; JLCPCB Part Class: Extended Part

## Nets
+3.3V: C1.2 C2.2 C4.2 C8#2.2 C9.2 C11.2 C12.2 C13.2 LED1.2(A) R3.1 R12#2.2 R13#2.2 R16.2 R20.2 R21.2 R22.2 U1.6(VDD) U1.7(REGIN) U2.5(VOUT) U4#2.5(VDDIO) U4#2.8(VDD) U4#2.12(CSB) U6.2(3V3) U7.1(VDD) U7.4(LEDA)
GND: BATTERY.2 C1.1 C2.1 C3.1 C4.1 C5.1 C7.1 C8.1 C8#2.1 C9.1 C11.1 C12.1 C13.1 D1.3 D3.1 LEFT.3 LEFT.4 Q3.1(E) Q3.4(E) R5.1 R6.1 R8.1 R10.1 R11.1 R13.1 RIGHT.3 RIGHT.4 SW1.1(A) SW1.3 SW1.4 SW1.5 U1.3(GND) U2.2(VSS) U4.2(GND) U4#2.1(SDO) U4#2.6(GNDIO) U4#2.7(GND) U6.1(GND) U6.15(GND) U6.38(GND) U6.39(GND) U7.3(GND) USB1.5(GND) USB1.6(SH1) USB1.7(SH2) USB1.8(SH3) USB1.9(SH4)
VBAT: BATTERY.1 C8.2 Q2.3(D) R12.2 U4.3(BAT)
VBUS: C7.2 D2.2 D3.2 D5.2(A) Q2.1(G) R8.2 U4.4(VCC) USB1.1(VBUS)
VIN: C3.2 D5.1(K) POWER.1 POWER.2 Q2.2(S) U2.1(VIN)
CHARGE: R17.1 U4.1(CHRG#) U6.6(IO34)
DTR: Q1.2(B) Q1.4(E) U1.28(DTR)
Esp_En: Q1.6(C) R16.1 U6.3(EN)
EXT_5V: D2.1 R4.1
GPIO0: Q1.3(C) U6.25(IO0)
GPIO2: U6.24(IO2)
IO35: R12.1 R13.2 U6.7(IO35)
KEY_LATCH: D7.2(A) U6.12(IO27)
KEY_ON: C5.2 D6.2(A) POWER.3 POWER.4 R10.2 U6.9(IO33)
LEDBLUE: Q3.5(B) U6.36(IO22)
LEDGREEN: Q3.2(B) U6.37(IO23)
LEFTBTN: LEFT.1 LEFT.2 R20.1 U6.33(IO21)
PAIR: R22.1 SW1.2(B)
RIGHTBTN: R21.1 RIGHT.1 RIGHT.2 U6.11(IO26)
RTS: Q1.1(E) Q1.5(B) U1.24(RTS)
RXD: R1.2 U1.25(RXD)
SCL: R13#2.1 U4#2.13(SCX) U6.30(IO18) U7.2(SCL)
SDA: R12#2.1 U4#2.14(SDX) U6.31(IO19) U7.8(SDA)
TXD: R2.2 U1.26(TXD)
U0RXD: R2.1 U6.34(RXD0)
U0TXD: R1.1 U6.35(TXD0)
usb_autoreset: R3.2 U1.9(RST#)
Net-(D1-1): D1.1 U1.5(D-) USB1.2(D-)
Net-(D1-2): D1.2 U1.4(D+) USB1.3(D+)
Net-(D6-1): D6.1(K) D7.1(K) U2.3(CE)
Net-(LED1-1): LED1.1(C) R18.2
Net-(LED1-3): LED1.3(C) R17.2
Net-(LED1-4): LED1.4(C) R19.2
Net-(Q3-3): Q3.3(C) R19.1
Net-(Q3-6): Q3.6(C) R18.1
Net-(R4-2): R4.2 R6.2 U1.8(VBUS)
Net-(R5-2): R5.2 U1.11(SUSPEND#)
Net-(R11-2): R11.2 U4.5(PROG)
Net-(U7-5): U7.5(LEDK) U7.6(LDR)

Not connected (* = marked no-connect by the designer): U1 1(DCD) 2(RI) 10(NC) 12(SUSPEND) 13(NC) 14(NC) 15(NC) 16(NC) 17(NC) 18(NC) 19(NC) 20(NC) 21(NC) 22(NC) 23(CTS) 27(DSR) 29(EP); U2 4(NC); U4#2 2(ASDX) 3(ASCX) 4(INT1) 9(INT2) 10(OCSB) 11(OSDO); U6 4(SENSOR_VP) 5(SENSOR_VN) 8(IO32) 10(IO25) 13(IO14) 14(IO12) 16(IO13) 17(NC) 18(NC) 19(NC) 20(NC) 21(NC) 22(NC) 23(IO15) 26(IO4) 27(IO16) 28(IO17) 29(IO5) 32(NC); U7 7(INT); USB1 4(ID)
